# Altium project ESP32_Projet.PrjPcb
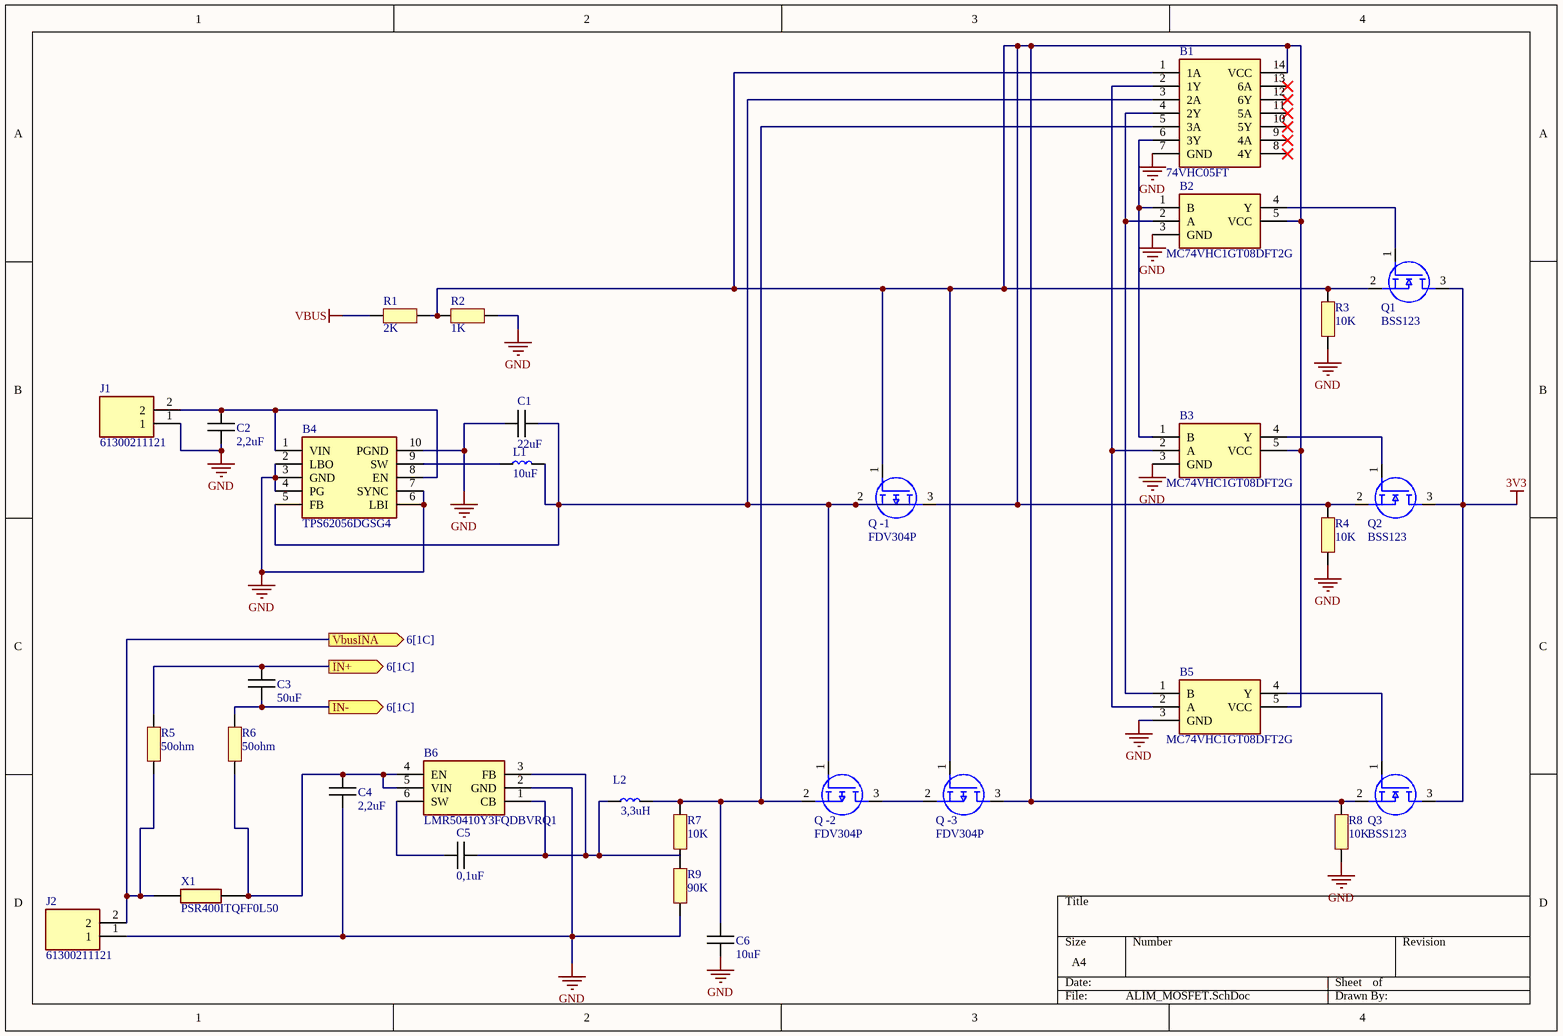
[diagram p0: ALIM_MOSFET.SchDoc]
8 sheets, 94 parts. Net scope: flat (ports and power ports of the same name join across sheets).
Board file: PCB1.PcbDoc
Sheets:
  Sheet1.SchDoc
  ALIM_MOSFET.SchDoc
  ANTENNE.SchDoc
  ESP.SchDoc
  HIM.SchDoc
  I2C.SchDoc
  SPI.SchDoc
  UART.SchDoc

## Sheet Sheet1.SchDoc
size A4; SheetNumber: 1; SheetTotal: 1

## Sheet ALIM_MOSFET.SchDoc
size A4; SheetNumber: 2; SheetTotal: 8

### Parts
B1  74VHC05FT  [SOP65P640X120-14N]
B2  MC74VHC1GT08DFT2G  [SOT65P210X110-5N]
B3  MC74VHC1GT08DFT2G  [SOT65P210X110-5N]
B4  TPS62056DGSG4  [SOP50P490X110-10N]
B5  MC74VHC1GT08DFT2G  [SOT65P210X110-5N]
B6  LMR50410Y3FQDBVRQ1  [SOT95P280X145-6N]
C1  22uF  [CAPC1005X06N]
C2  2,2uF  [CAPC1005X06N]
C3  50uF  [CAPC1005X06N]
C4  2,2uF  [CAPC1005X06N]
C5  0,1uF  [CAPC1005X06N]
C6  10uF  [CAPC1005X06N]
J1  61300211121  [61300211121]
J2  61300211121  [61300211121]
L1  10uF  [LQPC1005X06N]
L2  3,3uH  [LQPC1005X06N]
Q1  BSS123  [BSS123]
Q2  BSS123  [BSS123]
Q3  BSS123  [BSS123]
Q_-1  FDV304P  [SOT95P251X112-3N]
Q_-2  FDV304P  [SOT95P251X112-3N]
Q_-3  FDV304P  [SOT95P251X112-3N]
R1  2K  [RESC1005X06N]
R2  1K  [RESC1005X06N]
R3  10K  [RESC1005X06N]
R4  10K  [RESC1005X06N]
R5  50ohm  [RESC1005X06N]
R6  50ohm  [RESC1005X06N]
R7  10K  [RESC1005X06N]
R8  10K  [RESC1005X06N]
R9  90K  [RESC1005X06N]
X1  PSR400ITQFF0L50  [RESC10052X200N]

### Ports
IN+ (out, see 6[1C]), IN- (out, see 6[1C]), VbusINA (out, see 6[1C])

### Nets
3V3: Q1.3(D) Q2.3(D) Q3.3(D)
GND: B1.7(GND) B2.3(GND) B3.3(GND) B4.2(LBO) B4.3(GND) B4.4(PG) B4.6(LBI) B4.7(SYNC) B4.10(PGND) B5.3(GND) B6.2(GND) C1.2 C2.2 C4.2 C6.2 J1.1 J2.1 R2.2 R3.2 R4.2 R8.2 R9.2
VBUS: R1.1
NetB1_1: B1.1(1A) B1.14(VCC) B2.5(VCC) B3.5(VCC) B5.5(VCC) Q1.2(S) Q2.2(S) Q3.2(S) Q_-1.1(G) Q_-1.3(D) Q_-3.1(G) Q_-3.3(D) R1.2 R2.1 R3.1 R4.1 R8.1
NetB1_2: B1.2(1Y) B3.2(A) B5.2(A)
NetB1_3: B1.3(2A) B4.5(FB) C1.1 L1.2 Q_-1.2(S) Q_-2.1(G)
NetB1_4: B1.4(2Y) B2.2(A) B5.1(B)
NetB1_5: B1.5(3A) C6.1 L2.2 Q_-2.2(S) R7.1
NetB1_6: B1.6(3Y) B2.1(B) B3.1(B)
NetB2_4: B2.4(Y) Q1.1(G)
NetB3_4: B3.4(Y) Q2.1(G)
NetB4_1: B4.1(VIN) B4.8(EN) C2.1 J1.2
NetB4_9: B4.9(SW) L1.1
NetB5_4: B5.4(Y) Q3.1(G)
NetB6_1: B6.1(CB) B6.3(FB) C5.1 L2.1 R9.1
NetB6_4: B6.4(EN) B6.5(VIN) C4.1 R6.1 X1.2
NetB6_6: B6.6(SW) C5.2
NetB7_8: J2.2 R5.1 X1.1 ; port VbusINA
NetB7_9: C3.2 R6.2 ; port IN-
NetB7_10: C3.1 R5.2 ; port IN+
NetQ_-2_3: Q_-2.3(D) Q_-3.2(S)

Not connected (* = marked no-connect by the designer): B1 8(4Y)* 9(4A)* 10(5Y)* 11(5A)* 12(6Y)* 13(6A)*; R7 2

### Library data of the parts
B1 = 74VHC05FT: Logic Gates CMOS LOGIC IC INVERTER; Manufacturer_Name: Toshiba; Manufacturer_Part_Number: 74VHC05FT; Mouser Part Number: 757-74VHC05FT
B2 B3 B5 = MC74VHC1GT08DFT2G: Single 2-Input AND Gate, TTL Level; Manufacturer_Name: onsemi; Manufacturer_Part_Number: MC74VHC1GT08DFT2G; Parameter 3: *
B4 = TPS62056DGSG4: TEXAS INSTRUMENTS - TPS62056DGSG4 - Synchronous Buck (Step Down) Switching Regulator, Fixed, 2.7V-10Vin, 3.3V/0.8A out, 850kHz, VSSOP-10; Manufacturer_Name: Texas Instruments; Manufacturer_Part_Number: TPS62056DGSG4; Mouser Part Number: 595-TPS62056DGSG4
B6 = LMR50410Y3FQDBVRQ1: Régulateurs de tension de commutation Automotive qualified SIMPLE SWITCHER 4-V to 36-V, 1-A synchronous step-down converter 6-SOT-23 -40 to 150; Manufacturer_Name: Texas Instruments; Manufacturer_Part_Number: LMR50410Y3FQDBVRQ1; Mouser Part Number: 595-R50410Y3FQDBVRQ1
C1-C6 = Capacitor
J1 J2 = 61300211121: WURTH ELEKTRONIK - 61300211121 - HEADER, 2.54MM, PIN, THT, VERTICAL, 2WAY
L1 L2 = Bobine
Q1-Q3 = BSS123: BSS123 N-Channel MOSFET, 170 mA, 100 V PowerTrench, 3-Pin SOT-23 ON Semiconductor
Q_-1-Q_-3 = FDV304P: ON SEMICONDUCTOR - FDV304P - Power MOSFET, P Channel, 25 V, 460 mA, 1.22 ohm, SOT-23, Surface Mount; Manufacturer_Name: onsemi; Geometry.Height: 1.12mm; Manufacturer_Part_Number: FDV304P; Mouser Part Number: 512-FDV304P; Mouser Price/Stock: https://www.mouser.co.uk/ProductDetail/onsemi-Fairchild/FDV304P?qs=FOlmdCx%252BAA1BAlCQZu888w%3D%3D; Arrow Part Number: FDV304P; Arrow Price/Stock: https://www.arrow.com/en/products/fdv304p/on-semiconductor?utm_currency=USD&region=europe; Datasheet Link: https://componentsearchengine.com/Datasheets/2/FDV304P.pdf
R1-R9 = Resistor
X1 = PSR400ITQFF0L50: ROHM - PSR400ITQFF0L50 - SMD Current Sense Resistor, 500 ohm, PSR Series, 3921 [1052 Metric], 4 W, +/- 1%, Metal Strip; Manufacturer_Name: ROHM Semiconductor; Geometry.Height: 2mm; Manufacturer_Part_Number: PSR400ITQFF0L50; Mouser Part Number: 755-PSR400ITQFF0L50; Mouser Price/Stock: https://www.mouser.co.uk/ProductDetail/ROHM-Semiconductor/PSR400ITQFF0L50?qs=493kPxzlxfLaT1w5Mo%252BtHg%3D%3D; Arrow Part Number: *; Arrow Price/Stock: *; Datasheet Link: https://componentsearchengine.com/Datasheets/2/PSR400ITQFF0L50.pdf

## Sheet ANTENNE.SchDoc: Antenne
size A4; Revision: v1.0; SheetNumber: 3; SheetTotal: 8
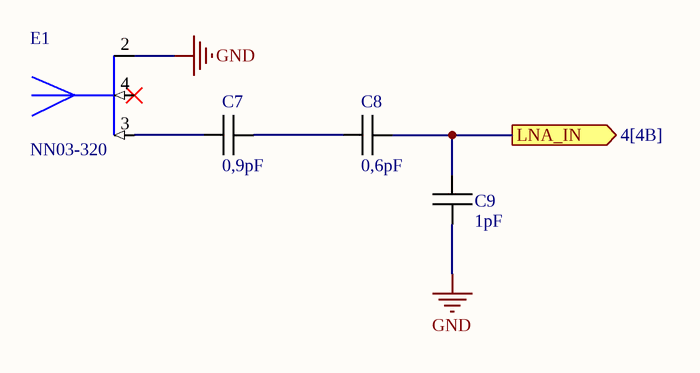
[diagram p1: ANTENNE.SchDoc]

### Parts
C7  0,9pF  [CAPC1005X06N]
C8  0,6pF  [CAPC1005X06N]
C9  1pF  [CAPC1005X06N]
E1  NN03-320  [XCVR_NN03-320]

### Ports
LNA_IN (out, see 4[4B])

### Nets
GND: C9.1 E1.2(GROUND)
NetC7_1: C7.1 E1.3(FEED_BLUETOOTH)
NetC7_2: C7.2 C8.1
NetC8_2: C8.2 C9.2 ; port LNA_IN

Not connected (* = marked no-connect by the designer): E1 4(FEED_GNSS)*

### Library data of the parts
C7-C9 = Capacitor
E1 = NN03-320: Dual port antenna booster for GNSS, Bluetooth, 5G and UWB (1561 - 1606MHz, 2400 - 2500MHz, 3400 - 3800MHz, 3100 - 4800MHz and 6000 - 10600 MHz), signal booster; Manufacturer_Name: Ignion; Manufacturer_Part_Number: NN03-320; Mouser Part Number: 128-NN03-320

## Sheet ESP.SchDoc: ESP32 PICO D4
size A4; Date: 04/19/2026; CheckedBy: Lanfroid-Nazac Guillaume; Author: Lanfroid-Nazac Guillaume; DrawnBy: DÉRONNE Mathis; Revision: v1.0; SheetNumber: 4; SheetTotal: 8
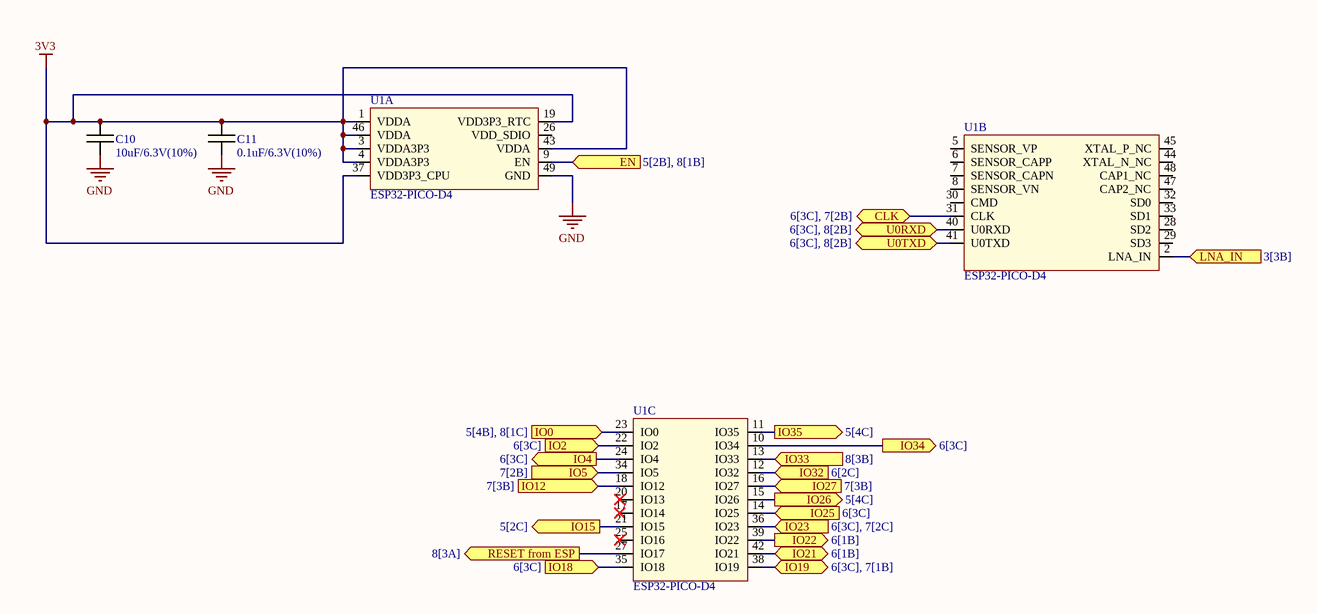
[diagram p2: ESP.SchDoc]

### Parts
C10  10uF/6.3V(10%)  [CAPC1005X06N]
C11  0.1uF/6.3V(10%)  [CAPC1005X06N]
U1  ESP32-PICO-D4  [PQFN50P700X700X104_HS-49N]  (parts A,B,C of 3)

### Ports
CLK (bidir, see 6[3C], 7[2B]), EN (in, see 5[2B], 8[1B]), IO0 (in, see 5[4B], 8[1C]), IO2 (in, see 6[3C]), IO4 (out, see 6[3C]), IO5 (in, see 7[2B]), IO12 (in, see 7[3B]), IO15 (out, see 5[2C]), IO18 (in, see 6[3C]), IO19 (bidir, see 6[3C], 7[1B]), IO21 (bidir, see 6[1B]), IO22 (out, see 6[1B]), IO23 (in, see 6[3C], 7[2C]), IO25 (in, see 6[3C]), IO26 (out, see 5[4C]), IO27 (in, see 7[3B]), IO32 (in, see 6[2C]), IO33 (in, see 8[3B]), IO34 (out, see 6[3C]), IO35 (out, see 5[4C]), LNA_IN (in, see 3[3B]), RESET from ESP (out, see 8[3A]), U0RXD (bidir, see 6[3C], 8[2B]), U0TXD (bidir, see 6[3C], 8[2B])

### Nets
3V3: C10.2 C11.2 U1.1(VDDA) U1.3(VDDA3P3) U1.4(VDDA3P3) U1.19(VDD3P3_RTC) U1.37(VDD3P3_CPU) U1.43(VDDA) U1.46(VDDA)
GND: C10.1 C11.1 U1.49(GND)
NetB7_3: U1.12(IO32) ; port IO32
NetB7_4: U1.42(IO21) ; port IO21
NetB7_5: U1.39(IO22) ; port IO22
NetB8_1: U1.34(IO5) ; port IO5
NetB8_3: U1.36(IO23) ; port IO23
NetB8_4: U1.31(CLK) ; port CLK
NetB8_5: U1.16(IO27) ; port IO27
NetB9_1: U1.18(IO12) ; port IO12
NetBOOT1_2: U1.23(IO0) ; port IO0
NetC8_2: U1.2(LNA_IN) ; port LNA_IN
NetD1_1: U1.11(IO35) ; port IO35
NetD1_3: U1.15(IO26) ; port IO26
NetJ5_1: U1.10(IO34) ; port IO34
NetJ5_2: U1.22(IO2) ; port IO2
NetJ5_3: U1.35(IO18) ; port IO18
NetJ5_5: U1.38(IO19) ; port IO19
NetJ5_9: U1.14(IO25) ; port IO25
NetJ5_10: U1.24(IO4) ; port IO4
NetJ5_11: U1.41(U0TXD) ; port U0TXD
NetJ5_12: U1.40(U0RXD) ; port U0RXD
NetLS1_P: U1.21(IO15) ; port IO15
NetQ7_2: U1.9(EN) ; port EN
NetR27_1: U1.27(IO17) ; port RESET from ESP
NetR28_1: U1.13(IO33) ; port IO33

Not connected (* = marked no-connect by the designer): U1 5(SENSOR_VP) 6(SENSOR_CAPP) 7(SENSOR_CAPN) 8(SENSOR_VN) 17(IO14)* 20(IO13)* 25(IO16)* 26(VDD_SDIO) 28(SD2) 29(SD3) 30(CMD) 32(SD0) 33(SD1) 44(XTAL_N_NC) 45(XTAL_P_NC) 47(CAP2_NC) 48(CAP1_NC)

### Library data of the parts
C10 C11 = Capacitor
U1 = ESP32: Système RF sur puce - SoC SIP module ESP32 with 4MByte Flash, Dual Core MCU, Wi-Fi & Bluetooth Combo, LGA48-pin, 7*7mm; Manufacturer 1: Espressif Systems; Supplier 1: Digi-Key; Supplier Part Number 1: 1904-1029-1-ND; Manufacturer Part Number 1: ESP32-PICO-D4

## Sheet HIM.SchDoc: IHM
size A4; Date: 04/19/2026; CheckedBy: Lanfroid-Nazac Guillaume; Author: DÉRONNE Mathis; DrawnBy: DÉRONNE Mathis; Revision: v1.1; SheetNumber: 5; SheetTotal: 8; ModifiedBy: Lanfroid-Nazac Guillaume
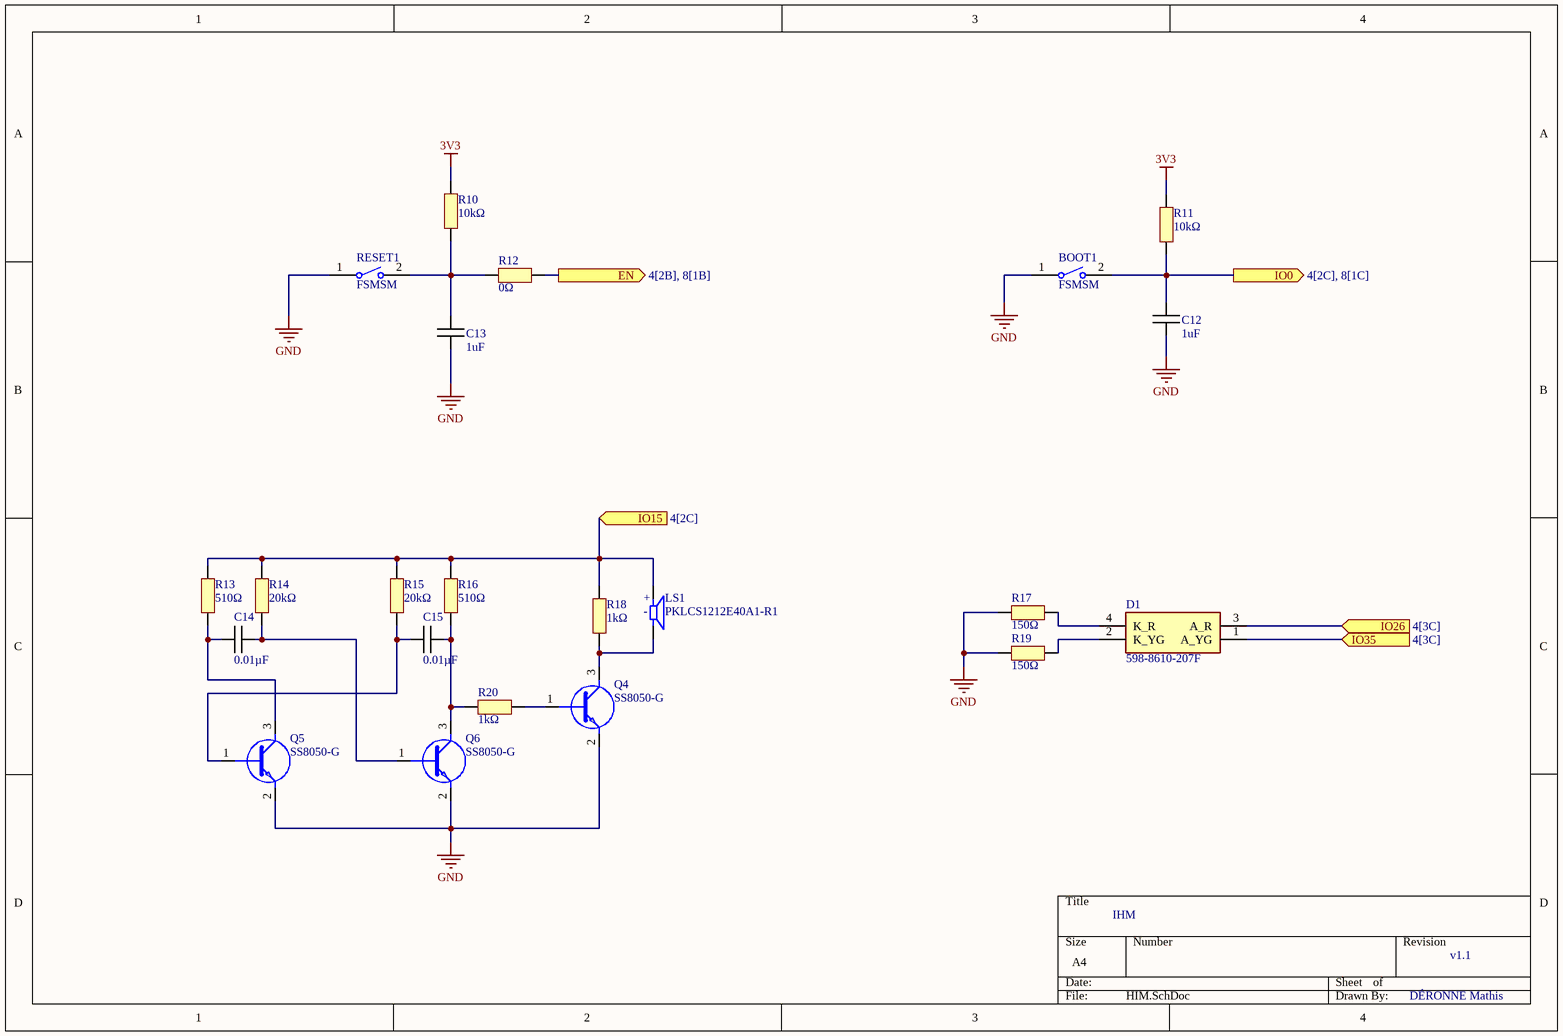
[diagram p3: HIM.SchDoc]

### Parts
BOOT1  FSMSM  [TECO-FSMSM-2_V]
C12  1uF  [CAPC1005X06N]
C13  1uF  [CAPC1005X06N]
C14  0.01µF  [CAPC1005X06N]
C15  0.01µF  [CAPC1005X06N]
D1  598-8610-207F  [5988610207F]
LS1  PKLCS1212E40A1-R1  [SPKR_PKLCS1212E40A1-R1]
Q4  SS8050-G  [SS8050-G]
Q5  SS8050-G  [SS8050-G]
Q6  SS8050-G  [SS8050-G]
R10  10kΩ  [RESC1005X06N]
R11  10kΩ  [RESC1005X06N]
R12  0Ω  [RESC1005X06N]
R13  510Ω  [RESC1005X06N]
R14  20kΩ  [RESC1005X06N]
R15  20kΩ  [RESC1005X06N]
R16  510Ω  [RESC1005X06N]
R17  150Ω  [RESC1005X06N]
R18  1kΩ  [RESC1005X06N]
R19  150Ω  [RESC1005X06N]
R20  1kΩ  [RESC1005X06N]
RESET1  FSMSM  [TECO-FSMSM-2_V]

### Ports
EN (out, see 4[2B], 8[1B]), IO0 (out, see 4[2C], 8[1C]), IO15 (in, see 4[2C]), IO26 (in, see 4[3C]), IO35 (in, see 4[3C])

### Nets
3V3: R10.2 R11.2
GND: BOOT1.1 C12.2 C13.2 Q4.2(E) Q5.2(E) Q6.2(E) R17.1 R19.1 RESET1.1
NetBOOT1_2: BOOT1.2 C12.1 R11.1 ; port IO0
NetC13_1: C13.1 R10.1 R12.1 RESET1.2
NetC14_1: C14.1 Q5.3(C) R13.1
NetC14_2: C14.2 Q6.1(B) R14.1
NetC15_1: C15.1 Q5.1(B) R15.1
NetC15_2: C15.2 Q6.3(C) R16.1 R20.1
NetD1_1: D1.1(A_YG) ; port IO35
NetD1_2: D1.2(K_YG) R19.2
NetD1_3: D1.3(A_R) ; port IO26
NetD1_4: D1.4(K_R) R17.2
NetLS1_N: LS1.N Q4.3(C) R18.1
NetLS1_P: LS1.P R13.2 R14.2 R15.2 R16.2 R18.2 ; port IO15
NetQ4_1: Q4.1(B) R20.2
NetQ7_2: R12.2 ; port EN

### Notes on the sheet
- (in symbol PKLCS1212E40A1-R1) +; -

### Library data of the parts
BOOT1 RESET1 = CMP-2000-07511-1: FSMSM Push Button Switch, 50 mA, -35 to 85 degC, 2-Pin SMD, RoHS, Bulk; Manufacturer: TE Connectivity; Actuator Length: 1.07mm; Electrical Life: 20000Cycles; Actuator Material: Polyamide; Current Rating: 50mA; Illumination Type: Illuminated; Voltage Rating (DC): 24V; Contact Resistance: 100mOhm; Case\/Package: SMD/SMT; Operating Force: 180gf; Switch Travel: 0.25mm; Max Voltage Rating (DC): 12V; Throw Configuration: SPST; Packaging: LoosePiece; Max Operating Temperature: 85degC; ELV: Compliant; Package Description: 2-Pin Surface Mount Device, Body 6 x 3.5 mm, Pitch 9.19 mm; RoHSCompliant: true; Manufacturer URL: http://www.te.com/; Contact Plating: Silver; Contact Material: Brass; Mounting Technology: SurfaceMount; Contact Current Rating: 50mA; Datasheet Version: Rev. C2, 08/2014; Datasheet URL: http://www.te.com/commerce/DocumentDelivery/DDEController?Action=showdoc&DocId=Customer+Drawing%7F1437566-3%7FC2%7Fpdf%7FEnglish%7FENG_CD_1437566-3_C2_1437566_3_1_c.dwg.pdf%7F1437566-3; Mechanical Life: 20000Cycles; Package Reference: FSMSM; REACH SVHC: Unknown; Orientation: Straight; Min Operating Temperature: -35degC; Lead Free: LeadFree; Termination: GullWing; Package Quantity: 1000; Mount: SurfaceMount
C12-C15 = Capacitor
D1 = 598-8610-207F: Standard LEDs - SMD Red/Green WC 80/50mcd 645/570nm; Manufacturer_Name: Dialight; Geometry.Height: 0.8mm; Manufacturer_Part_Number: 598-8610-207F; Mouser Part Number: 645-598-8610-207F; Mouser Price/Stock: https://www.mouser.co.uk/ProductDetail/Dialight/598-8610-207F?qs=7JStj%2FjQ2SFuCjosqwklHQ%3D%3D; Arrow Part Number: 598-8610-207F; Arrow Price/Stock: https://www.arrow.com/en/products/598-8610-207f/dialight?region=nac; Datasheet Link: https://media.digikey.com/pdf/Data%20Sheets/Dialight%20PDFs/598%20Series%201210%20Pkg%20Bi-Color.pdf
LS1 = PKLCS1212E40A1-R1: Buzzers Transducer, Externally Driven Piezo 1.5V 2kHz 70dB @ 1.5V, 10cm Surface Mount Solder Pads; MF: Murata Electronics; Value: *; MP: PKLCS1212E40A1-R1; Package: None; Availability: Unavailable; Price: None
Q4-Q6 = SS8050-G: Bipolar Transistors - BJT NPN TRANSISTOR 1.5A 40V
R10-R20 = Resistor

## Sheet I2C.SchDoc: I2C
size A4; Date: 04/19/2026; Author: Lanfroid-Nazac Guillaume; DrawnBy: Lanfroid-Nazac Guillaume; Revision: v1.0; SheetNumber: 6; SheetTotal: 8
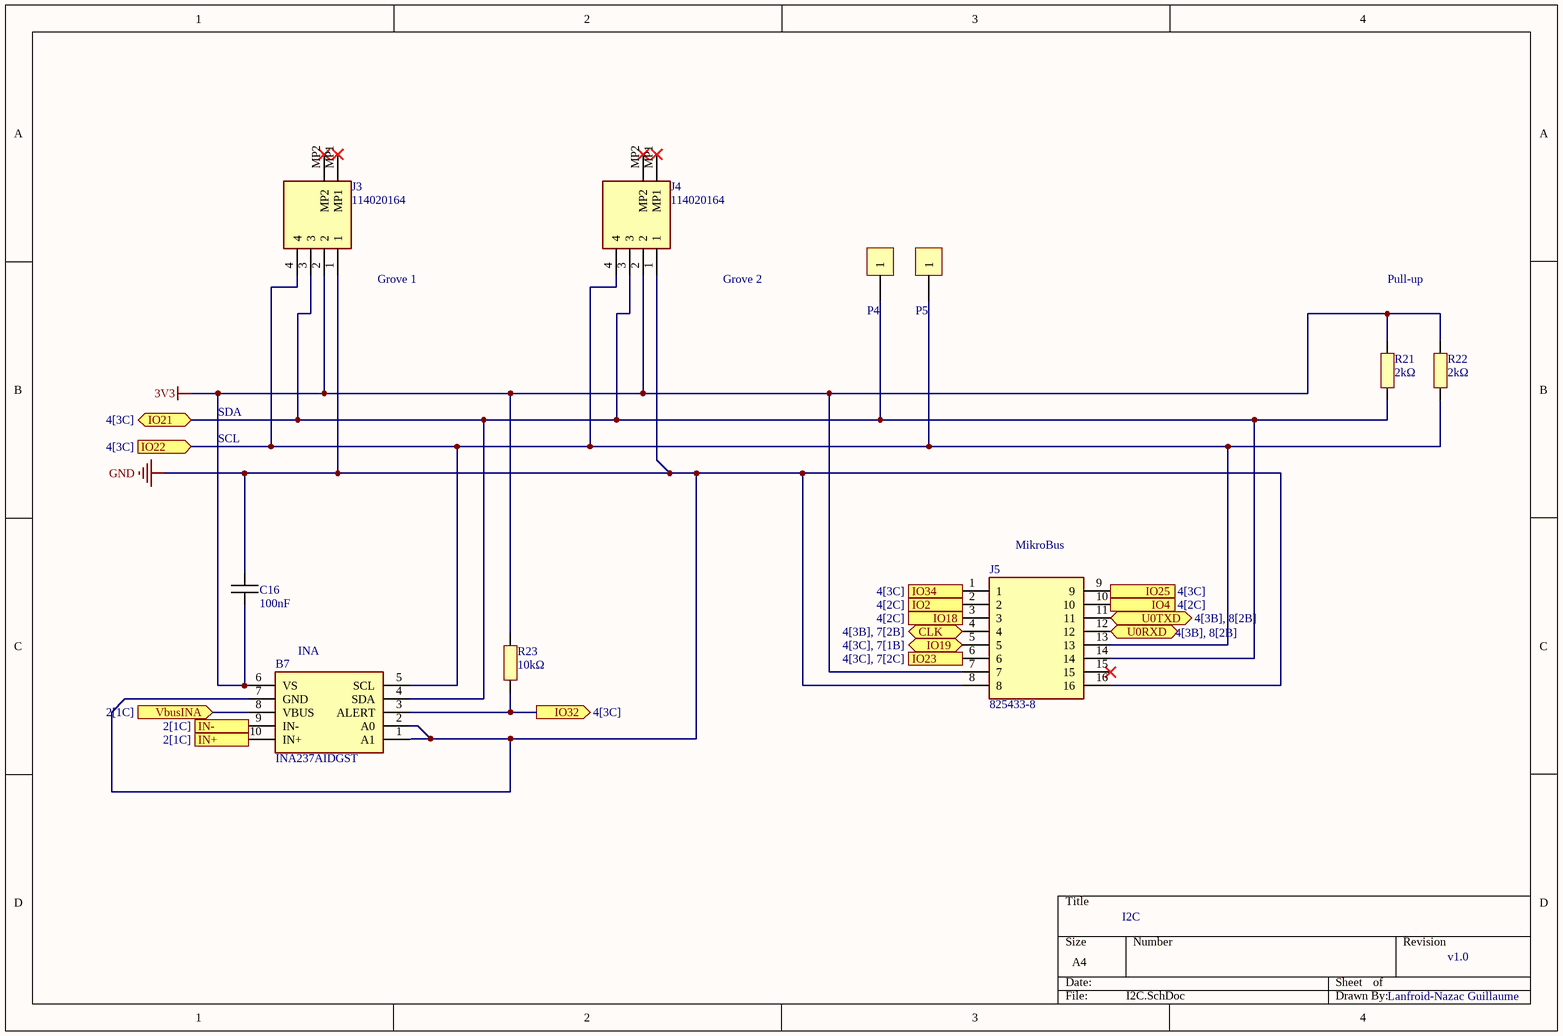
[diagram p4: I2C.SchDoc]

### Parts
B7  INA237AIDGST  [SOP50P490X110-10N]
C16  100nF  [CAPC1005X06N]
J3  114020164  [114020164]
J4  114020164  [114020164]
J5  825433-8  [Connect-Mikrobus]
P4  Plage CMS 10x5  [Plage CMS 10x5]  (value not drawn)  (no BOM)
P5  Plage CMS 10x5  [Plage CMS 10x5]  (value not drawn)  (no BOM)
R21  2kΩ  [RESC1005X06N]
R22  2kΩ  [RESC1005X06N]
R23  10kΩ  [RESC1005X06N]

### Ports
CLK (bidir, see 4[3B], 7[2B]), IN+ (in, see 2[1C]), IN- (in, see 2[1C]), IO2 (out, see 4[2C]), IO4 (in, see 4[2C]), IO18 (out, see 4[2C]), IO19 (bidir, see 4[3C], 7[1B]), IO21 (bidir, see 4[3C]), IO22 (in, see 4[3C]), IO23 (out, see 4[3C], 7[2C]), IO25 (out, see 4[3C]), IO32 (out, see 4[3C]), IO34 (in, see 4[3C]), U0RXD (bidir, see 4[3B], 8[2B]), U0TXD (bidir, see 4[3B], 8[2B]), VbusINA (in, see 2[1C])

### Nets
3V3: B7.6(VS) C16.1 J3.2 J4.2 J5.7 R21.1 R22.1 R23.1
GND: B7.1(A1) B7.2(A0) B7.7(GND) C16.2 J3.1 J4.1 J5.8 J5.16
NetB7_3: B7.3(ALERT) R23.2 ; port IO32
NetB7_4: B7.4(SDA) J3.3 J4.3 J5.14 P4.1 R21.2 ; port IO21
NetB7_5: B7.5(SCL) J3.4 J4.4 J5.13 P5.1 R22.2 ; port IO22
NetB7_8: B7.8(VBUS) ; port VbusINA
NetB7_9: B7.9(IN-) ; port IN-
NetB7_10: B7.10(IN+) ; port IN+
NetB8_3: J5.6 ; port IO23
NetB8_4: J5.4 ; port CLK
NetJ5_1: J5.1 ; port IO34
NetJ5_2: J5.2 ; port IO2
NetJ5_3: J5.3 ; port IO18
NetJ5_5: J5.5 ; port IO19
NetJ5_9: J5.9 ; port IO25
NetJ5_10: J5.10 ; port IO4
NetJ5_11: J5.11 ; port U0TXD
NetJ5_12: J5.12 ; port U0RXD

Not connected (* = marked no-connect by the designer): J3 MP1* MP2*; J4 MP1* MP2*; J5 15*

### Notes on the sheet
- (near J3) Grove 1
- Grove 2
- Pull-up
- SDA
- SCL
- (near J5) MikroBus
- (near B7) INA

### Library data of the parts
B7 = INA237AIDGST: Current Sense Amplifiers 85-V, 16-bit, I2C output current/voltage/power monitor with alert 10-VSSOP -40 to 125; Manufacturer_Name: Texas Instruments; Manufacturer_Part_Number: INA237AIDGST; Mouser Part Number: 595-INA237AIDGST
C16 = Capacitor
J3 J4 = 114020164: Seeed Studio Accessories Grove Female Header - SMD-4P-2.0mm-90D-20Pcs; Manufacturer_Name: Seeed Studio; Manufacturer_Part_Number: 114020164; Mouser Part Number: 713-114020164
J5 = Connect-Mikrobus: Headers & Wire Housings 8P double for connection mikrobus; Manufacturer_Name: TE Connectivity; Manufacturer_Part_Number: 825433-8; Mouser Part Number: 571-825433-8
P4 P5 = Plage CMS 10x5: Plage de report CMS 10x5mm; PN: L30; Value: Plage CMS 10x5; Footprint_statut: ok
R21-R23 = Resistor

## Sheet SPI.SchDoc: Temperature
size A4; Date: 04/19/2026; Author: Lanfroid-Nazac Guillaume; DrawnBy: Lanfroid-Nazac Guillaume; Revision: v1.0; SheetNumber: 7; SheetTotal: 8
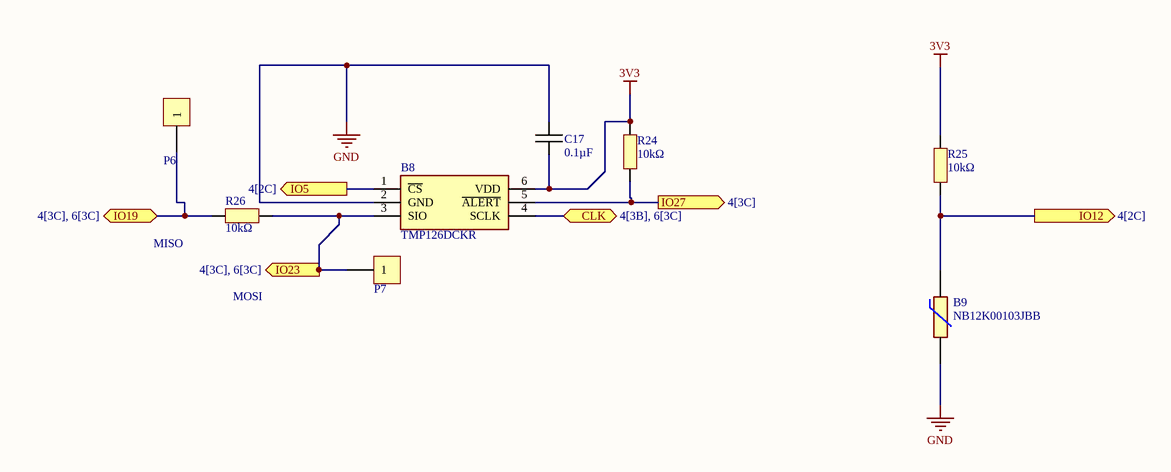
[diagram p5: SPI.SchDoc]

### Parts
B8  TMP126DCKR  [SOT65P210X110-6N]
B9  NB12K00103JBB  [RESC2212X50N]
C17  0.1µF  [CAPC1005X06N]
P6  Plage CMS 10x5  [Plage CMS 10x5]  (value not drawn)  (no BOM)
P7  Plage CMS 10x5  [Plage CMS 10x5]  (value not drawn)  (no BOM)
R24  10kΩ  [RESC1005X06N]
R25  10kΩ  [RESC1005X06N]
R26  10kΩ  [RESC1005X06N]

### Ports
CLK (bidir, see 4[3B], 6[3C]), IO5 (out, see 4[2C]), IO12 (out, see 4[2C]), IO19 (bidir, see 4[3C], 6[3C]), IO23 (out, see 4[3C], 6[3C]), IO27 (out, see 4[3C])

### Nets
3V3: B8.6(VDD) C17.1 R24.2 R25.1
GND: B8.2(GND) B9.2 C17.2
NetB8_1: B8.1(~{CS}) ; port IO5
NetB8_3: B8.3(SIO) P7.1 R26.1 ; port IO23
NetB8_4: B8.4(SCLK) ; port CLK
NetB8_5: B8.5(~{ALERT}) R24.1 ; port IO27
NetB9_1: B9.1 R25.2 ; port IO12
NetJ5_5: P6.1 R26.2 ; port IO19

### Notes on the sheet
- (near R26) MISO
- MOSI

### Library data of the parts
B8 = TMP126DCKR: Board Mount Temperature Sensors +/-0.25 C SPI temperature sensor with 175 C operation, CRC and slew-rate alert; Manufacturer_Name: Texas Instruments; Manufacturer_Part_Number: TMP126DCKR; Mouser Part Number: 595-TMP126DCKR
B9 = NB12K00103JBB: NTC SMD Thermistor, NB12K, 10K, 5% AVX 10k 0805 Protection NTC Thermistor, 5s, 2 x 1.25 x 1.3mm; Manufacturer_Name: Kyocera AVX; Geometry.Height: 0.5mm; Manufacturer_Part_Number: NB12K00103JBB; Mouser Part Number: 581-NB12K00103JBB; Mouser Price/Stock: https://www.mouser.co.uk/ProductDetail/AVX/NB12K00103JBB/?qs=4%252B6%252BTdINQeDPvI%252BQUQjJ3Q%3D%3D; Arrow Part Number: NB12K00103JBB; Arrow Price/Stock: https://www.arrow.com/en/products/nb12k00103jbb/avx; Datasheet Link: https://datasheet.datasheetarchive.com/originals/distributors/Datasheets-DGA6/551314.pdf
C17 = Capacitor
P6 P7 = Plage CMS 10x5: Plage de report CMS 10x5mm; PN: L30; Value: Plage CMS 10x5; Footprint_statut: ok
R24-R26 = Resistor

## Sheet UART.SchDoc
size A4; SheetNumber: 8; SheetTotal: 8
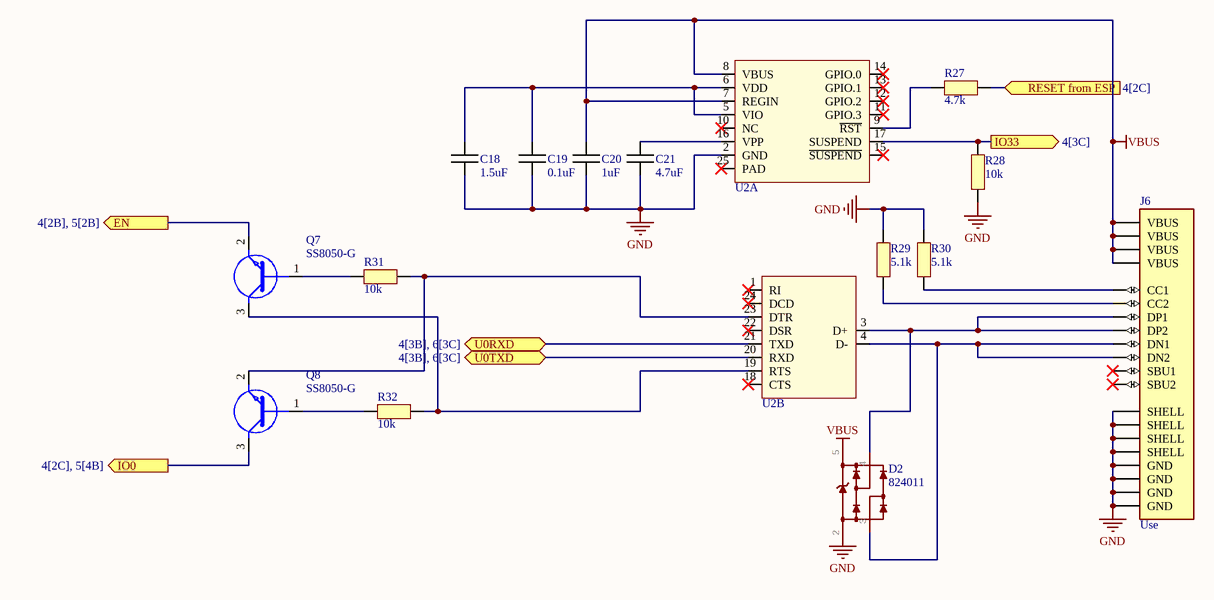
[diagram p6: UART.SchDoc]

### Parts
C18  1.5uF  [CAPC1005X06N]
C19  0.1uF  [CAPC1005X06N]
C20  1uF  [CAPC1005X06N]
C21  4.7uF  [CAPC1005X06N]
D2  824011  [824011]
J6  Use  [USB4085-GF-A]
Q7  SS8050-G  [SS8050-G]
Q8  SS8050-G  [SS8050-G]
R27  4.7k  [RESC1005X06N]
R28  10k  [RESC1005X06N]
R29  5.1k  [RESC1005X06N]
R30  5.1k  [RESC1005X06N]
R31  10k  [RESC1005X06N]
R32  10k  [RESC1005X06N]
U2  CP2104-F03-GM  [PQFN50P400X400X80_HS-25N]  (value not drawn)  (parts A,B of 2)

### Ports
EN (out, see 4[2B], 5[2B]), IO0 (out, see 4[2C], 5[4B]), IO33 (out, see 4[3C]), RESET from ESP (in, see 4[2C]), U0RXD (bidir, see 4[3B], 6[3C]), U0TXD (bidir, see 4[3B], 6[3C])

### Nets
GND: C18.2 C19.2 C20.2 C21.2 D2.2(GND) J6.A1(GND) J6.A12(GND) J6.B1(GND) J6.B12(GND) J6.S1(SHELL) J6.S2(SHELL) J6.S3(SHELL) J6.S4(SHELL) R28.2 R29.2 R30.2 U2.2(GND)
VBUS: C20.1 D2.5(VDD) J6.A4(VBUS) J6.A9(VBUS) J6.B4(VBUS) J6.B9(VBUS) U2.7(REGIN) U2.8(VBUS)
NetBOOT1_2: Q8.3(C) ; port IO0
NetC18_1: C18.1 C19.1 U2.5(VIO) U2.6(VDD)
NetC21_1: C21.1 U2.16(VPP)
NetD2_3: D2.3 J6.A7(DN1) J6.B7(DN2) U2.4(D-)
NetD2_4: D2.4 J6.A6(DP1) J6.B6(DP2) U2.3(D+)
NetJ5_11: U2.20(RXD) ; port U0TXD
NetJ5_12: U2.21(TXD) ; port U0RXD
NetJ6_A5: J6.A5(CC1) R30.1
NetJ6_B5: J6.B5(CC2) R29.1
NetQ7_1: Q7.1(B) R31.2
NetQ7_2: Q7.2(E) ; port EN
NetQ7_3: Q7.3(C) R32.1 U2.19(RTS)
NetQ8_1: Q8.1(B) R32.2
NetQ8_2: Q8.2(E) R31.1 U2.23(DTR)
NetR27_1: R27.1 ; port RESET from ESP
NetR27_2: R27.2 U2.9(~{RST})
NetR28_1: R28.1 U2.17(SUSPEND) ; port IO33

Not connected (* = marked no-connect by the designer): J6 A8(SBU1)* B8(SBU2)*; U2 1(RI)* 10(NC)* 11(GPIO.3)* 12(GPIO.2)* 13(GPIO.1)* 14(GPIO.0)* 15(~{SUSPEND})* 18(CTS)* 22(DSR)* 24(DCD)* 25(PAD)*

### Library data of the parts
C18-C21 = Capacitor
D2 = 824011: TVS Diode Array WE-TVS, High Speed Series  - Low capazity - No leakage current - Low clamping voltage - high ESD voltage protection  -- USB 1.0 - 2.0
J6 = USB4085-GF-A: Connecteurs USB USB Type C, 2.0, Rec, TH , G/F, RA , Top Mnt, T & R
Q7 Q8 = SS8050-G: as Q4 on sheet HIM
R27-R32 = Resistor
U2 = USBBridge: USB Bridge, USB to UART USB 2.0 UART Interface 24-QFN (4x4); Manufacturer 1: Silicon Labs; Supplier 1: Arrow Electronics; Supplier Part Number 1: CP2104-F03-GM; Manufacturer Part Number 1: CP2104-F03-GM

## Nets that join several sheets
3V3: ALIM_MOSFET (Q1.3 Q2.3 Q3.3), ESP (9 pins), HIM (R10.2 R11.2), I2C (8 pins), SPI (B8.6 C17.1 R24.2 R25.1)
GND: ALIM_MOSFET (22 pins), ANTENNE (C9.1 E1.2), ESP (C10.1 C11.1 U1.49), HIM (9 pins), I2C (8 pins), SPI (B8.2 B9.2 C17.2), UART (17 pins)
VBUS: ALIM_MOSFET (R1.1), UART (8 pins)
NetB7_3: ESP (U1.12), I2C (B7.3 R23.2)
NetB7_4: ESP (U1.42), I2C (6 pins)
NetB7_5: ESP (U1.39), I2C (6 pins)
NetB7_8: ALIM_MOSFET (J2.2 R5.1 X1.1), I2C (B7.8)
NetB7_9: ALIM_MOSFET (C3.2 R6.2), I2C (B7.9)
NetB7_10: ALIM_MOSFET (C3.1 R5.2), I2C (B7.10)
NetB8_1: ESP (U1.34), SPI (B8.1)
NetB8_3: ESP (U1.36), I2C (J5.6), SPI (B8.3 P7.1 R26.1)
NetB8_4: ESP (U1.31), I2C (J5.4), SPI (B8.4)
NetB8_5: ESP (U1.16), SPI (B8.5 R24.1)
NetB9_1: ESP (U1.18), SPI (B9.1 R25.2)
NetBOOT1_2: ESP (U1.23), HIM (BOOT1.2 C12.1 R11.1), UART (Q8.3)
NetC8_2: ANTENNE (C8.2 C9.2), ESP (U1.2)
NetD1_1: ESP (U1.11), HIM (D1.1)
NetD1_3: ESP (U1.15), HIM (D1.3)
NetJ5_1: ESP (U1.10), I2C (J5.1)
NetJ5_2: ESP (U1.22), I2C (J5.2)
NetJ5_3: ESP (U1.35), I2C (J5.3)
NetJ5_5: ESP (U1.38), I2C (J5.5), SPI (P6.1 R26.2)
NetJ5_9: ESP (U1.14), I2C (J5.9)
NetJ5_10: ESP (U1.24), I2C (J5.10)
NetJ5_11: ESP (U1.41), I2C (J5.11), UART (U2.20)
NetJ5_12: ESP (U1.40), I2C (J5.12), UART (U2.21)
NetLS1_P: ESP (U1.21), HIM (6 pins)
NetQ7_2: ESP (U1.9), HIM (R12.2), UART (Q7.2)
NetR27_1: ESP (U1.27), UART (R27.1)
NetR28_1: ESP (U1.13), UART (R28.1 U2.17)

## Assembly variants
rev A: all parts fitted